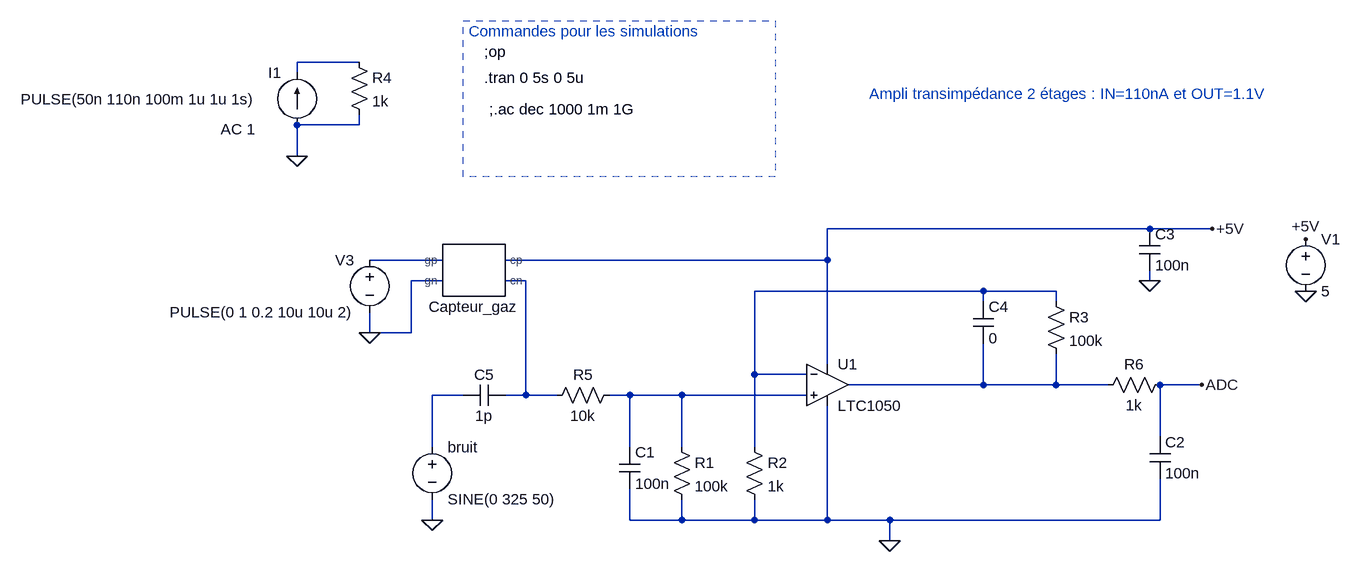
[diagram p0: schematic shieldCircuit.asc]
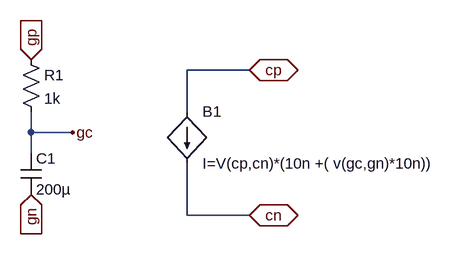
[diagram p1: sub-circuit gassensor.asc]
shieldCircuit.asc, the LTspice schematic file:
Version 4
SHEET 1 1000 680
WIRE -512 -336 -608 -336
WIRE -608 -320 -608 -336
WIRE -512 -240 -512 -256
WIRE -512 -240 -608 -240
WIRE -608 -192 -608 -240
WIRE 704 -80 208 -80
WIRE 800 -80 704 -80
WIRE -384 -32 -496 -32
WIRE 208 -32 208 -80
WIRE 208 -32 -288 -32
WIRE -384 0 -432 0
WIRE -256 0 -288 0
WIRE 704 0 704 -16
WIRE 448 16 96 16
WIRE 560 16 448 16
WIRE 448 32 448 16
WIRE 560 32 560 16
WIRE -496 80 -496 48
WIRE -432 80 -432 0
WIRE -432 80 -496 80
WIRE 208 128 208 -32
WIRE 96 144 96 16
WIRE 176 144 96 144
WIRE 448 160 448 96
WIRE 448 160 240 160
WIRE 560 160 560 112
WIRE 560 160 448 160
WIRE 640 160 560 160
WIRE 784 160 720 160
WIRE -352 176 -400 176
WIRE -256 176 -256 0
WIRE -256 176 -288 176
WIRE -208 176 -256 176
WIRE -96 176 -128 176
WIRE -16 176 -96 176
WIRE 176 176 -16 176
WIRE 720 240 720 160
WIRE -400 256 -400 176
WIRE -96 256 -96 176
WIRE -16 256 -16 176
WIRE 96 256 96 144
WIRE -400 368 -400 336
WIRE -96 368 -96 320
WIRE -16 368 -16 336
WIRE -16 368 -96 368
WIRE 96 368 96 336
WIRE 96 368 -16 368
WIRE 208 368 208 192
WIRE 208 368 96 368
WIRE 304 368 208 368
WIRE 720 368 720 304
WIRE 720 368 304 368
WIRE 304 400 304 368
FLAG 944 -64 +5V
FLAG 944 16 0
FLAG -608 -192 0
FLAG 304 400 0
FLAG 800 -80 +5V
FLAG 704 0 0
FLAG 784 160 ADC
FLAG -400 368 0
FLAG -496 80 0
SYMBOL Opamps\\LTC1050 208 96 R0
SYMATTR InstName U1
SYMBOL voltage 944 -80 R0
WINDOW 123 0 0 Left 2
WINDOW 39 0 0 Left 2
SYMATTR InstName V1
SYMATTR Value 5
SYMBOL res -32 240 R0
SYMATTR InstName R1
SYMATTR Value 100k
SYMBOL res 80 240 R0
SYMATTR InstName R2
SYMATTR Value 1k
SYMBOL res 544 16 R0
SYMATTR InstName R3
SYMATTR Value 100k
SYMBOL res 736 144 R90
WINDOW 0 0 56 VBottom 2
WINDOW 3 32 56 VTop 2
SYMATTR InstName R6
SYMATTR Value 1k
SYMBOL res -112 160 R90
WINDOW 0 0 56 VBottom 2
WINDOW 3 32 56 VTop 2
SYMATTR InstName R5
SYMATTR Value 10k
SYMBOL cap -112 256 R0
SYMATTR InstName C1
SYMATTR Value 100n
SYMBOL cap 704 240 R0
SYMATTR InstName C2
SYMATTR Value 100n
SYMBOL cap 688 -80 R0
SYMATTR InstName C3
SYMATTR Value 100n
SYMBOL cap 432 32 R0
SYMATTR InstName C4
SYMATTR Value 0
SYMBOL current -608 -240 R180
WINDOW 0 24 80 Left 2
WINDOW 3 62 39 Left 2
WINDOW 123 64 -7 Left 2
WINDOW 39 0 0 Left 2
SYMATTR InstName I1
SYMATTR Value PULSE(50n 110n 100m 1u 1u 1s)
SYMATTR Value2 AC 1
SYMBOL voltage -400 240 R0
WINDOW 123 0 0 Left 2
WINDOW 39 0 0 Left 2
SYMATTR InstName bruit
SYMATTR Value SINE(0 325 50)
SYMBOL cap -288 160 R90
WINDOW 0 0 32 VBottom 2
WINDOW 3 32 32 VTop 2
SYMATTR InstName C5
SYMATTR Value 1p
SYMBOL gasSensor -336 -16 M180
SYMATTR InstName Capteur_gaz
SYMBOL voltage -496 -48 M0
WINDOW 123 0 0 Left 2
WINDOW 39 0 0 Left 2
SYMATTR InstName V3
SYMATTR Value PULSE(0 1 0.2 10u 10u 2)
SYMBOL res -528 -352 R0
SYMATTR InstName R4
SYMATTR Value 1k
TEXT -320 -352 Left 2 !;op
TEXT -344 -384 Left 2 ;Commandes pour les simulations
TEXT 272 -288 Left 2 ;Ampli transimpédance 2 étages : IN=110nA et OUT=1.1V
TEXT -320 -312 Left 2 !.tran 0 5s 0 5u
TEXT -312 -264 Left 2 !;.ac dec 1000 1m 1G
RECTANGLE Normal 128 -160 -352 -400 2

gassensor.asc, the sub-circuit schematic file:
Version 4
SHEET 1 880 680
WIRE 368 64 272 64
WIRE 272 128 272 64
WIRE 32 160 32 128
WIRE 96 160 32 160
WIRE 32 192 32 160
WIRE 272 288 272 208
WIRE 368 288 272 288
FLAG 32 48 gp
IOPIN 32 48 In
FLAG 32 256 gn
IOPIN 32 256 In
FLAG 96 160 gc
FLAG 368 64 cp
IOPIN 368 64 BiDir
FLAG 368 288 cn
IOPIN 368 288 BiDir
SYMBOL res 16 32 R0
SYMATTR InstName R1
SYMATTR Value 1k
SYMBOL cap 16 192 R0
SYMATTR InstName C1
SYMATTR Value 200µ
SYMBOL bi 272 128 R0
SYMATTR InstName B1
SYMATTR Value I=V(cp,cn)*(10n +( v(gc,gn)*10n))

The netlist it stands for:
* shieldCircuit.asc
XU1 N007 N004 +5V 0 N005 LTC1050  ; pins In+ In- V+ V- OUT
V1 +5V 0 5
R1 N007 0 100k
R2 N004 0 1k
R3 N004 N005 100k
R6 ADC N005 1k
R5 N007 N003 10k
C1 N007 0 100n
C2 ADC 0 100n
C3 +5V 0 100n
C4 N004 N005 0
I1 0 N001 PULSE(50n 110n 100m 1u 1u 1s) AC 1
V§bruit N006 0 SINE(0 325 50)
C5 N003 N006 1p
XCapteur_gaz 0 N002 N003 +5V gassensor
V3 N002 0 PULSE(0 1 0.2 10u 10u 2)
R4 N001 0 1k

* block symbol definitions
.subckt gassensor gn gp cn cp
R1 gp gc 1k
C1 gc gn 200µ
B1 cp cn I=V(cp,cn)*(10n +( v(gc,gn)*10n))
.ends gassensor

;op
* Commandes pour les simulations
* Ampli transimpédance 2 étages : IN=110nA et OUT=1.1V
.tran 0 5s 0 5u
;.ac dec 1000 1m 1G
.lib LTC.lib
.backanno
.end